# Altium schematic sheet CPU ROM.SchDoc
size A4; SheetNumber: 9; SheetTotal: 15
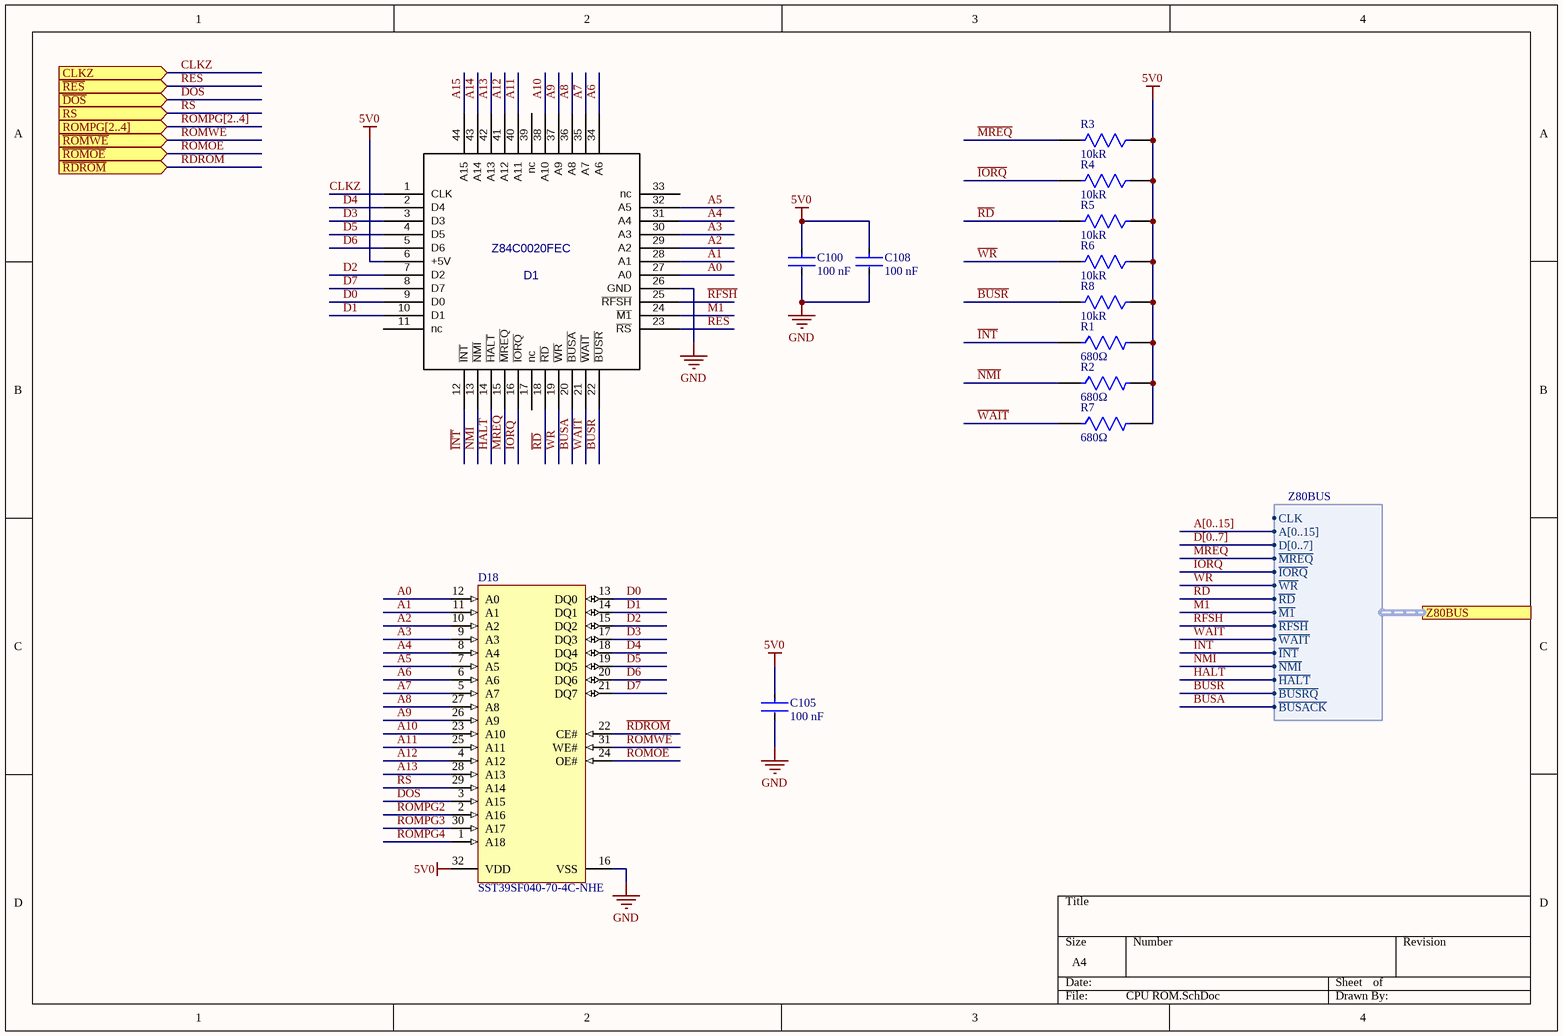
[diagram p0: CPU ROM.SchDoc]

## Parts
C100  Capacitance: 100 nF  [FP-CC0805-0_85-IPC_A]  (hidden comment: CC0805KRX7R9BB104)
C105  Capacitance: 100 nF  [FP-CC0805-0_85-IPC_A]  (hidden comment: CC0805KRX7R9BB104)
C108  Capacitance: 100 nF  [FP-CC0805-0_85-IPC_A]  (hidden comment: CC0805KRX7R9BB104)
D1  Z84C0020FEC  [QFP44X8]
D18  SST39SF040-70-4C-NHE  [MCHP-PLCC-NH32_L]
R1  value 680Ω  [FP-RT0805-IPC_A]  (hidden comment: RT0805FRE07680RL)
R2  value 680Ω  [FP-RT0805-IPC_A]  (hidden comment: RT0805FRE07680RL)
R3  Resistance: 10kR  [FP-CR0805-IPC_A]  (hidden comment: CR0805-JW-103ELF)
R4  Resistance: 10kR  [FP-CR0805-IPC_A]  (hidden comment: CR0805-JW-103ELF)
R5  Resistance: 10kR  [FP-CR0805-IPC_A]  (hidden comment: CR0805-JW-103ELF)
R6  Resistance: 10kR  [FP-CR0805-IPC_A]  (hidden comment: CR0805-JW-103ELF)
R7  value 680Ω  [FP-RT0805-IPC_A]  (hidden comment: RT0805FRE07680RL)
R8  Resistance: 10kR  [FP-CR0805-IPC_A]  (hidden comment: CR0805-JW-103ELF)

## Ports
CLKZ (in), ROMPG[2..4] (in), RS (in), Z80BUS (harness Z80BUS), ~{DOS} (in), ~{RDROM} (in), ~{RES} (in), ~{ROMOE} (in), ~{ROMWE} (in)

## Harnesses
Z80BUS: A[0..15], D[0..7], ~{MREQ}, ~{IORQ}, ~{WR}, ~{RD}, ~{M1}, ~{RFSH}, ~{WAIT}, ~{INT}, ~{NMI}, ~{HALT}, ~{BUSRQ}, ~{BUSACK}, CLK

## Nets
5V0: C100.1 C105.1 C108.1 D1.6(+5V) D18.32(VDD) R1.2 R2.2 R3.1 R4.1 R5.1 R6.1 R7.2 R8.1
GND: C100.2 C105.2 C108.2 D1.26(GND) D18.16(VSS)
A0: D1.27(A0) D18.12(A0)
A1: D1.28(A1) D18.11(A1)
A2: D1.29(A2) D18.10(A2)
A3: D1.30(A3) D18.9(A3)
A4: D1.31(A4) D18.8(A4)
A5: D1.32(A5) D18.7(A5)
A6: D1.34(A6) D18.6(A6)
A7: D1.35(A7) D18.5(A7)
A8: D1.36(A8) D18.27(A8)
A9: D1.37(A9) D18.26(A9)
A10: D1.38(A10) D18.23(A10)
A11: D1.40(A11) D18.25(A11)
A12: D1.41(A12) D18.4(A12)
A13: D1.42(A13) D18.28(A13)
A14: D1.43(A14)
A15: D1.44(A15)
~{BUSA}: D1.20(~{BUSA}) ; port Z80BUS.~{BUSACK}
~{BUSR}: D1.22(~{BUSR}) R8.2 ; port Z80BUS.~{BUSRQ}
CLKZ: D1.1(CLK) ; port CLKZ
D0: D1.9(D0) D18.13(DQ0)
D1: D1.10(D1) D18.14(DQ1)
D2: D1.7(D2) D18.15(DQ2)
D3: D1.3(D3) D18.17(DQ3)
D4: D1.2(D4) D18.18(DQ4)
D5: D1.4(D5) D18.19(DQ5)
D6: D1.5(D6) D18.20(DQ6)
D7: D1.8(D7) D18.21(DQ7)
~{DOS}: D18.3(A15) ; port ~{DOS}
~{HALT}: D1.14(~{HALT}) ; port Z80BUS.~{HALT}
~{INT}: D1.12(~{INT}) R1.1 ; port Z80BUS.~{INT}
~{IORQ}: D1.16(~{IORQ}) R4.2 ; port Z80BUS.~{IORQ}
~{M1}: D1.24(~{M1}) ; port Z80BUS.~{M1}
~{MREQ}: D1.15(~{MREQ}) R3.2 ; port Z80BUS.~{MREQ}
~{NMI}: D1.13(~{NMI}) R2.1 ; port Z80BUS.~{NMI}
~{RD}: D1.18(~{RD}) R5.2 ; port Z80BUS.~{RD}
~{RDROM}: D18.22(CE#) ; port ~{RDROM}
~{RES}: D1.23(~{RS}) ; port ~{RES}
~{RFSH}: D1.25(~{RFSH}) ; port Z80BUS.~{RFSH}
~{ROMOE}: D18.24(OE#) ; port ~{ROMOE}
~{ROMWE}: D18.31(WE#) ; port ~{ROMWE}
ROMPG2: D18.2(A16)
ROMPG3: D18.30(A17)
ROMPG4: D18.1(A18)
RS: D18.29(A14) ; port RS
~{WAIT}: D1.21(~{WAIT}) R7.1 ; port Z80BUS.~{WAIT}
~{WR}: D1.19(~{WR}) R6.2 ; port Z80BUS.~{WR}

Not connected (* = marked no-connect by the designer): D1 11(nc) 17(nc) 33(nc) 39(nc)

## Buses and harness runs
bus A[0..15]
bus D[0..7]
bus ROMPG[2..4] = port ROMPG[2..4]

## Library data of the parts
C100 C105 C108 = CMP-2100-03606-3: CAP CER 0.1UF 50V X7R 0805; Manufacturer: Yageo; Value: 100 nF; Manufacturer Part Number: CC0805KRX7R9BB104; Category: Cap; Case/Package: 0805
D18 = CMP-0378-00006-1: 4 Mbit Multi-Purpose Flash, 4.5 to 5.5 V, 1 kHz, 0 to 70 degC, 32-pin PLCC (NH32), Tube; Manufacturer: Microchip; PartNumber: SST39SF040-70-4C-NHE; PackageDescription: 32-lead Plastic Lead Chip Carrier, 11.43 x 13.97 mm Body, 1.27 mm Pitch; Manufacturer Part Number: SST39SF040-70-4C-NHE; value: SST39SF040-70-4C-NHE; Case/Package: PLCC-32; Category: IC
R1 R2 R7 = CMP-03412-000082-1: RES SMD 680 OHM 1% 1/8W 0805; Manufacturer: Yageo; Category: Res; Manufacturer Part Number: RT0805FRE07680RL; Resistance: 680Ω; Case/Package: 0805
R3-R6 R8 = CMP-07231-003873-1: Thick Film Chip Resistors 0805 10kΩ 0.125W 5% 200ppm/°C; Manufacturer: Bourns; value: 10kΩ; Manufacturer Part Number: CR0805-JW-103ELF; Number of Terminations: 2; Termination: SMD/SMT; Number of Pins: 2; Case/Package: 0805; Category: Res
D1 = Z84C0020FEC: Value: Z84C0020FEC; Case/Package: QFP-44; Category: IC